# EAGLE design ApoBoard_2017_V0_3 (EAGLE 7.3.0)
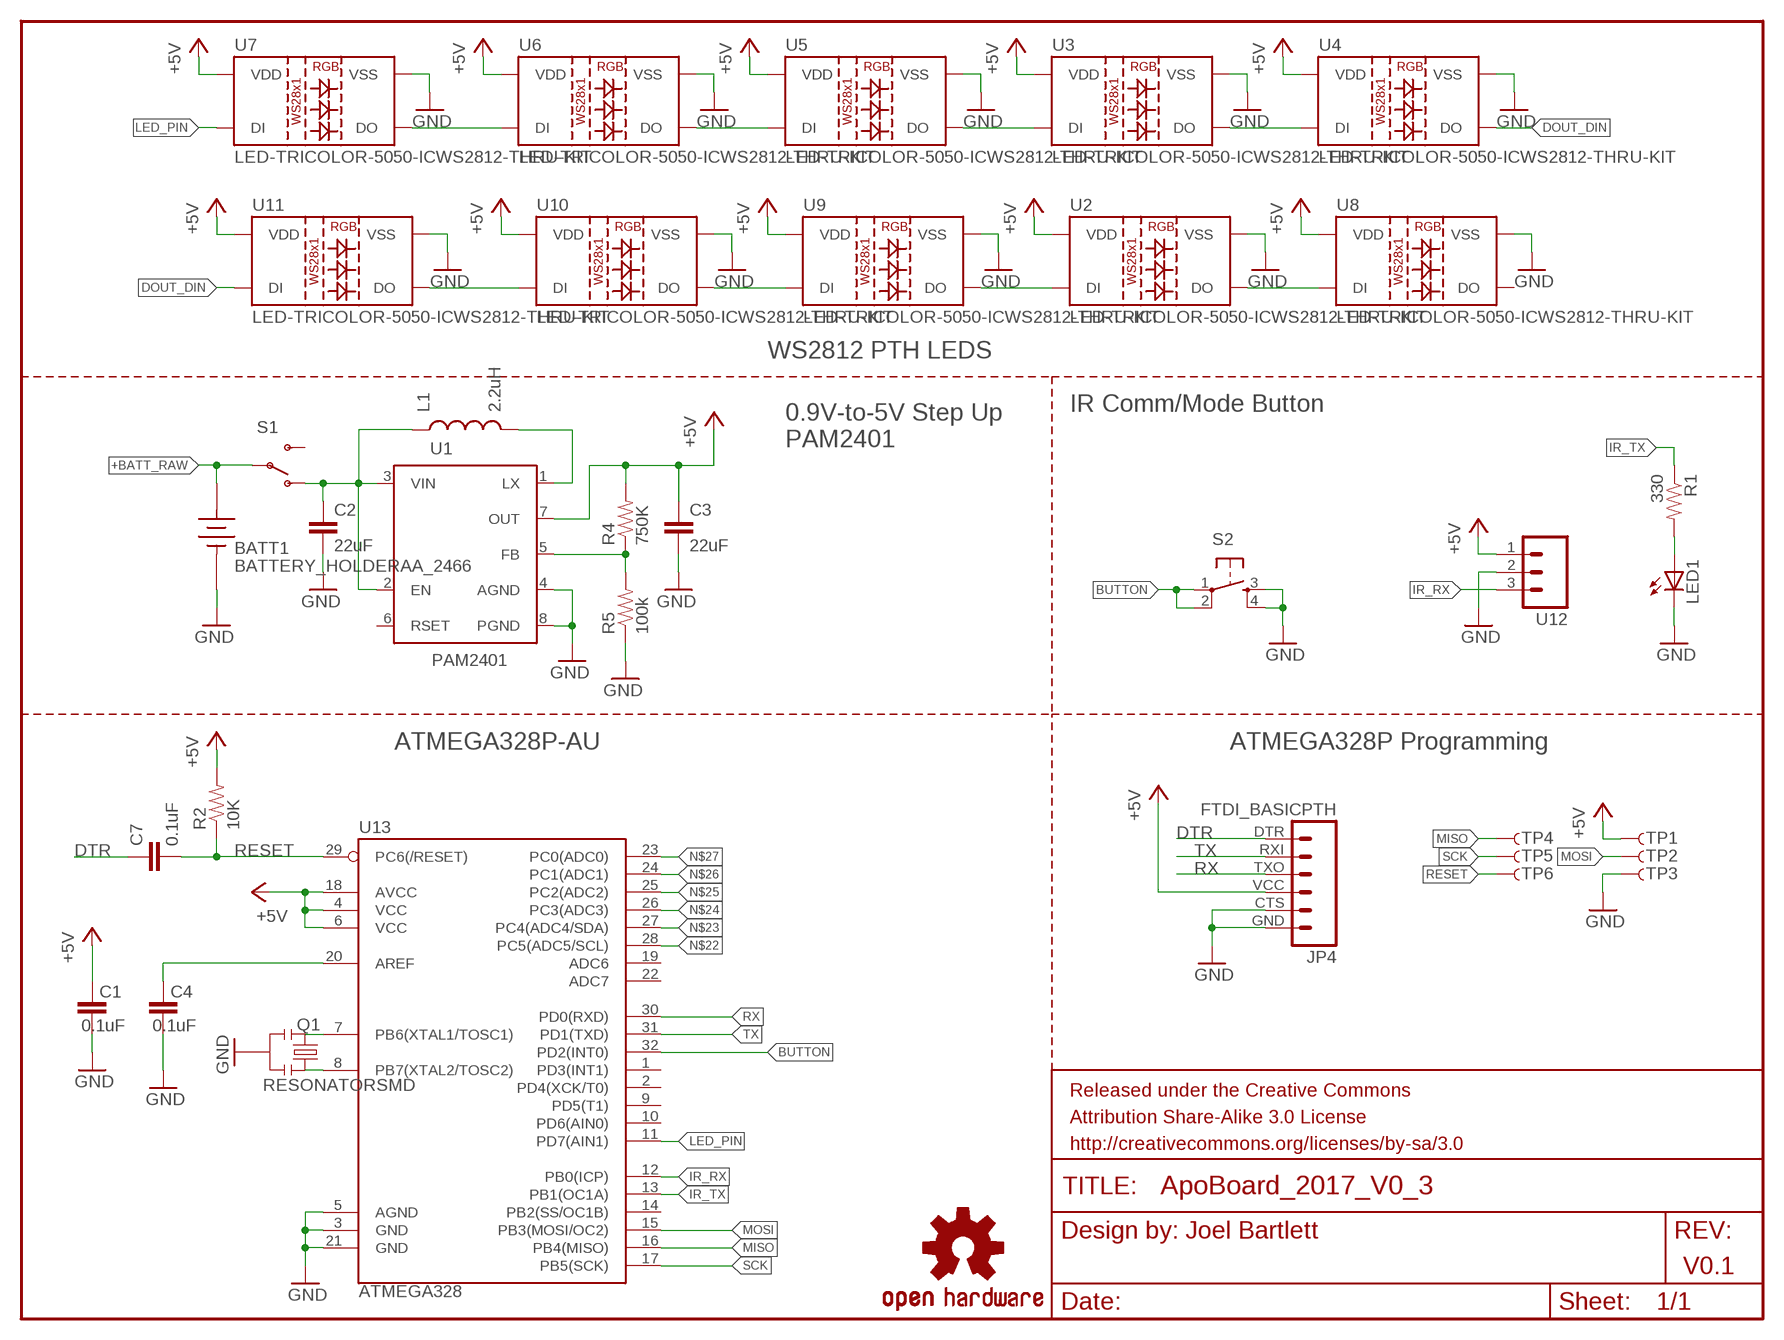
[diagram p0: schematic, sheet 1]

## Parts
BATT1  BATTERY_HOLDERAA_2466  [BATT_HOLDER_AA_2466]
C1  0.1uF  CAP0402-CAP  [0402-CAP]
C2  22uF  22UF-6.3V-20%(0805)  [0805]
C3  22uF  22UF-6.3V-20%(0805)  [0805]
C4  0.1uF  CAP0402-CAP  [0402-CAP]
C7  0.1uF  CAP0402-CAP  [0402-CAP]
FRAME1  FRAME-LETTER  [CREATIVE_COMMONS]
JP4  FTDI_BASICPTH  [FTDI_BASIC]
L1  2.2uH  INDUCTOR.  [CDRH2D09]
LED1  LED5MM-KIT  [LED5MM-KIT]
LOGO1  OSHW-LOGOS  [OSHW-LOGO-S]
Q1  RESONATORSMD  [RESONATOR-SMD]
R1  330  RESISTORKIT  [AXIAL-0.3-KIT]
R2  10K  RESISTOR0402-RES  [0402-RES]
R4  750K  10K-1%RES-00824  [0603-RES]
R5  100k  10K-1%RES-00824  [0603-RES]
S1  SWITCH-SPSTKIT  [SWITCH-SPDT_KIT]
S2  TAC_SWITCHPTH  [TACTILE-PTH]
TP1  TP-3x5  TEST-POINT3X5  [PAD.03X.05]
TP2  TP-3x5  TEST-POINT3X5  [PAD.03X.05]
TP3  TP-3x5  TEST-POINT3X5  [PAD.03X.05]
TP4  TP-3x5  TEST-POINT3X5  [PAD.03X.05]
TP5  TP-3x5  TEST-POINT3X5  [PAD.03X.05]
TP6  TP-3x5  TEST-POINT3X5  [PAD.03X.05]
U1  PAM2401  [MSOP8]
U2  LED-TRICOLOR-5050-ICWS2812-THRU-KIT  [LED-RGB-THRU-KIT]
U3  LED-TRICOLOR-5050-ICWS2812-THRU-KIT  [LED-RGB-THRU-KIT]
U4  LED-TRICOLOR-5050-ICWS2812-THRU-KIT  [LED-RGB-THRU-KIT]
U5  LED-TRICOLOR-5050-ICWS2812-THRU-KIT  [LED-RGB-THRU-KIT]
U6  LED-TRICOLOR-5050-ICWS2812-THRU-KIT  [LED-RGB-THRU-KIT]
U7  LED-TRICOLOR-5050-ICWS2812-THRU-KIT  [LED-RGB-THRU-KIT]
U8  LED-TRICOLOR-5050-ICWS2812-THRU-KIT  [LED-RGB-THRU-KIT]
U9  LED-TRICOLOR-5050-ICWS2812-THRU-KIT  [LED-RGB-THRU-KIT]
U10  LED-TRICOLOR-5050-ICWS2812-THRU-KIT  [LED-RGB-THRU-KIT]
U11  LED-TRICOLOR-5050-ICWS2812-THRU-KIT  [LED-RGB-THRU-KIT]
U12  M03IR_RECEIVER  [1X03_IR_RECEIVER]
U13  ATMEGA328  ATMEGA168  [TQFP32-08]

## Nets
+5V: C1.2 C3.1 JP4.VCC R2.2 R4.2 TP1.P$1 U1.7(OUT) U2.2(VDD) U3.2(VDD) U4.2(VDD) U5.2(VDD) U6.2(VDD) U7.2(VDD) U8.2(VDD) U9.2(VDD) U10.2(VDD) U11.2(VDD) U12.1 U13.4(VCC) U13.6(VCC) U13.18(AVCC)
+BATT_RAW: BATT1.P S1.2(P)
AREF: C4.2 U13.20(AREF)
BUTTON: S2.1 S2.2 U13.32(PD2(INT0))
DOUT_DIN: U4.4(DO) U11.1(DI)
DTR: C7.1 JP4.DTR
GND: BATT1.N C1.1 C2.2 C3.2 C4.1 JP4.CTS JP4.GND LED1.K(C) Q1.2 R5.1 S2.3 S2.4 TP3.P$1 U1.4(AGND) U1.8(PGND) U2.3(VSS) U3.3(VSS) U4.3(VSS) U5.3(VSS) U6.3(VSS) U7.3(VSS) U8.3(VSS) U9.3(VSS) U10.3(VSS) U11.3(VSS) U12.2 U13.3(GND) U13.5(AGND) U13.21(GND)
IR_RX: U12.3 U13.12(PB0(ICP))
IR_TX: R1.P$1 U13.13(PB1(OC1A))
LED_PIN: U7.1(DI) U13.11(PD7(AIN1))
MISO: TP4.P$1 U13.16(PB4(MISO))
MOSI: TP2.P$1 U13.15(PB3(MOSI/OC2))
N$1: U6.1(DI) U7.4(DO)
N$2: U5.1(DI) U6.4(DO)
N$3: LED1.A R1.P$2
N$5: U3.1(DI) U5.4(DO)
N$6: U3.4(DO) U4.1(DI)
N$8: L1.P$2 U1.1(LX)
N$9: U10.1(DI) U11.4(DO)
N$10: C2.1 L1.P$1 S1.1(O) U1.2(EN) U1.3(VIN)
N$11: U9.1(DI) U10.4(DO)
N$12: R4.1 R5.2 U1.5(FB)
N$13: U2.1(DI) U9.4(DO)
N$14: U2.4(DO) U8.1(DI)
N$22: U13.28(PC5(ADC5/SCL))
N$23: U13.27(PC4(ADC4/SDA))
N$24: U13.26(PC3(ADC3))
N$25: U13.25(PC2(ADC2))
N$26: U13.24(PC1(ADC1))
N$27: U13.23(PC0(ADC0))
N$29: Q1.1 U13.8(PB7(XTAL2/TOSC2))
N$30: Q1.3 U13.7(PB6(XTAL1/TOSC1))
RESET: C7.2 R2.1 TP6.P$1 U13.29(PC6(/RESET))
RX: JP4.TXO U13.30(PD0(RXD))
SCK: TP5.P$1 U13.17(PB5(SCK))
TX: JP4.RXI U13.31(PD1(TXD))
Unconnected: S1.3(S) U1.6(RSET) U8.4(DO) U13.1(PD3(INT1)) U13.2(PD4(XCK/T0)) U13.9(PD5(T1)) U13.10(PD6(AIN0)) U13.14(PB2(SS/OC1B)) U13.19(ADC6) U13.22(ADC7)

## Notes on the sheet
- WS2812 PTH LEDS
- IR Comm/Mode Button
- 0.9V-to-5V Step Up
  PAM2401
- ATMEGA328P-AU | ATMEGA328P Programming
- Joel Bartlett
- V0.1

## Library data of the parts
BATT1 = 1_BES_ELECTROMECHANICAL:BATTERY_HOLDER
C1 C4 C7 = SparkFun:CAP: Capacitor Standard 0603 ceramic capacitor, and 0.1" leaded capacitor.
C2 C3 = SparkFun-Capacitors:22UF-6.3V-20%(0805): Ceramic CAP-08402; PROD_ID: CAP-08402
FRAME1 = SparkFun-Aesthetics:FRAME-LETTER: Schematic Frame Standard 8.5x11 US Letter frame
JP4 = SparkFun-Connectors:FTDI_BASIC: FTDI Basic header with labels
L1 = SparkFun-Passives:INDUCTOR: Inductors Basic Inductor/Choke - 0603 and 1206. Footprints are not proven and vary greatly between part numbers.
LED1 = SparkFun-LED:LED: LEDs Standard schematic elements and footprints for 5mm, 3mm, 1206, and 0603 sized LEDs. 5mm - Spark Fun Electronics SKU : COM-00529 (and others)
LOGO1 = SparkFun-Aesthetics:OSHW-LOGO: Open Source Hardware Logo This logo indicates the piece of hardware it is found on incorporates a OSHW license and/or adheres to the definition of open source hardware found here: http://freedomdefined.org/OSHW
Q1 = SparkFun:RESONATOR: Resonator Small SMD resonator. This is the itty bitty 10/20MHz resonators with built in caps. CSTCE10M0G55 and CSTCE20M0V53. Footprint has been reviewed closely but hasn't been tested yet.
R1 = SparkFun-Resistors:RESISTOR: Resistor Basic schematic elements and footprints for 0603, 1206, and PTH resistors.
R2 = SparkFun:RESISTOR: Resistor Basic schematic elements and footprints for 0603, 1206, and PTH resistors.
R4 R5 = SparkFun-Resistors:10K-1%: 10k-ohm SMT 1/10W - 1% (0603) RES-00824; PROD_ID: RES-00824; VALUE: 10k
S1 = SparkFun:SWITCH-SPST: SPST Switch Simple slide switch. Spark Fun Electronics SKU : COM-00102
S2 = SparkFun-Electromechanical:TAC_SWITCH: Momentary Switch Button commonly used for reset or general input. Spark Fun Electronics SKU : COM-00097 SMT- SWCH-08247
TP1-TP6 = SparkFun-Passives:TEST-POINT: Bare copper test points for troubleshooting or ICT
U1 = SparkFun-PowerIC:PAM2401
U2-U11 = SparkFun-LED:LED-TRICOLOR-5050-IC: KIT KIT KITr 5x5mm SMD LED with built-in controller IC. DIO-11598
U12 = SparkFun-Connectors:M03: Header 3 Standard 3-pin 0.1" header. Use with straight break away headers (SKU : PRT-00116), right angle break away headers (PRT-00553), swiss pins (PRT-00743), machine pins (PRT-00117), and female headers (PRT-00115). Molex polarized connector foot print use with SKU : PRT-08232 with associated crimp pins and housings.
U13 = SparkFun:ATMEGA168

## Net classes
0 default: width 0.152 mm, drill 0.305 mm, clearance 0.152 mm
1 vcc: width 0.254 mm
3 ButtonSignal: width 0.254 mm

## Board
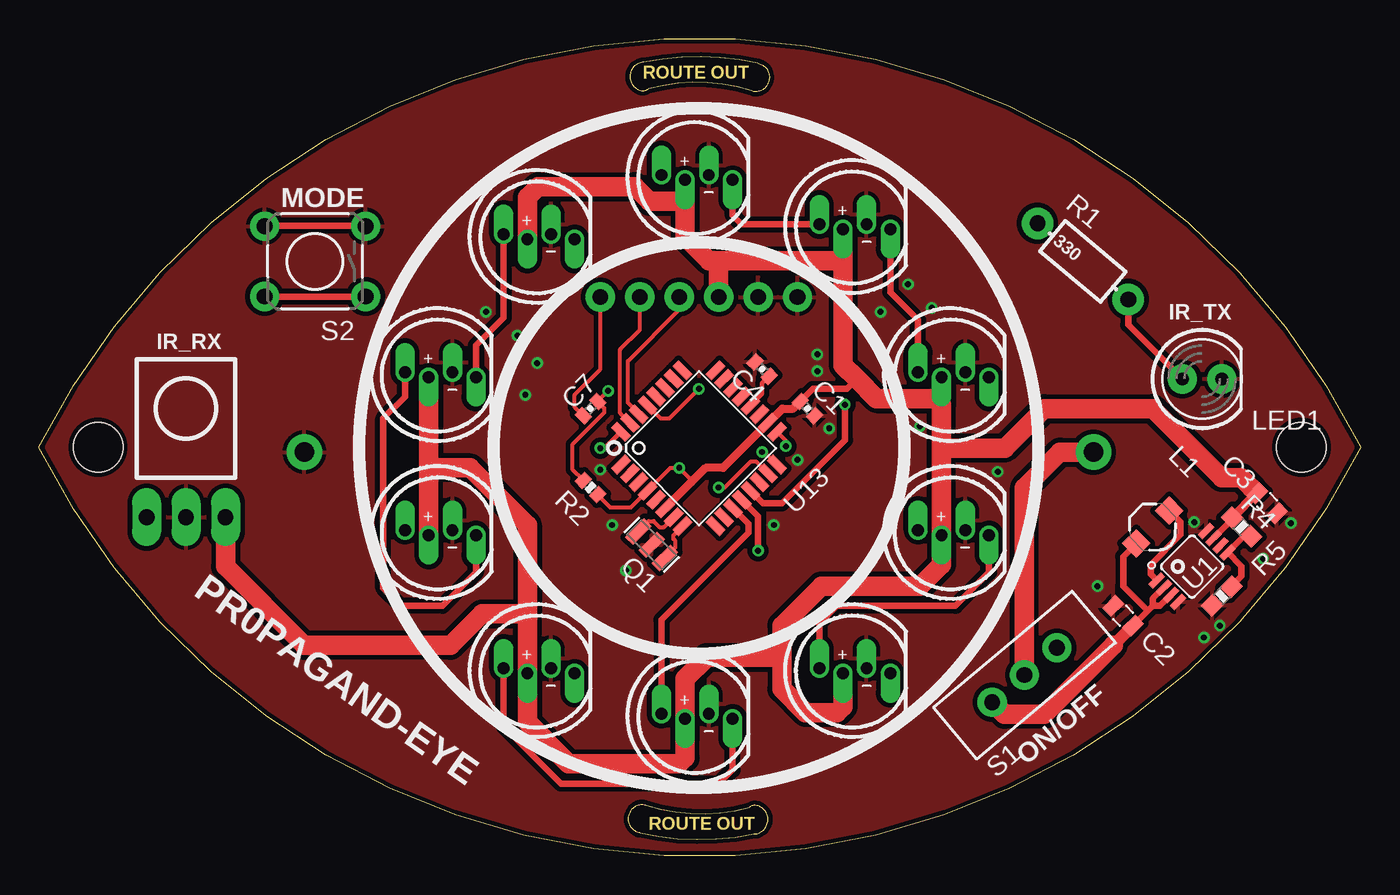
[diagram p1: board, top side]
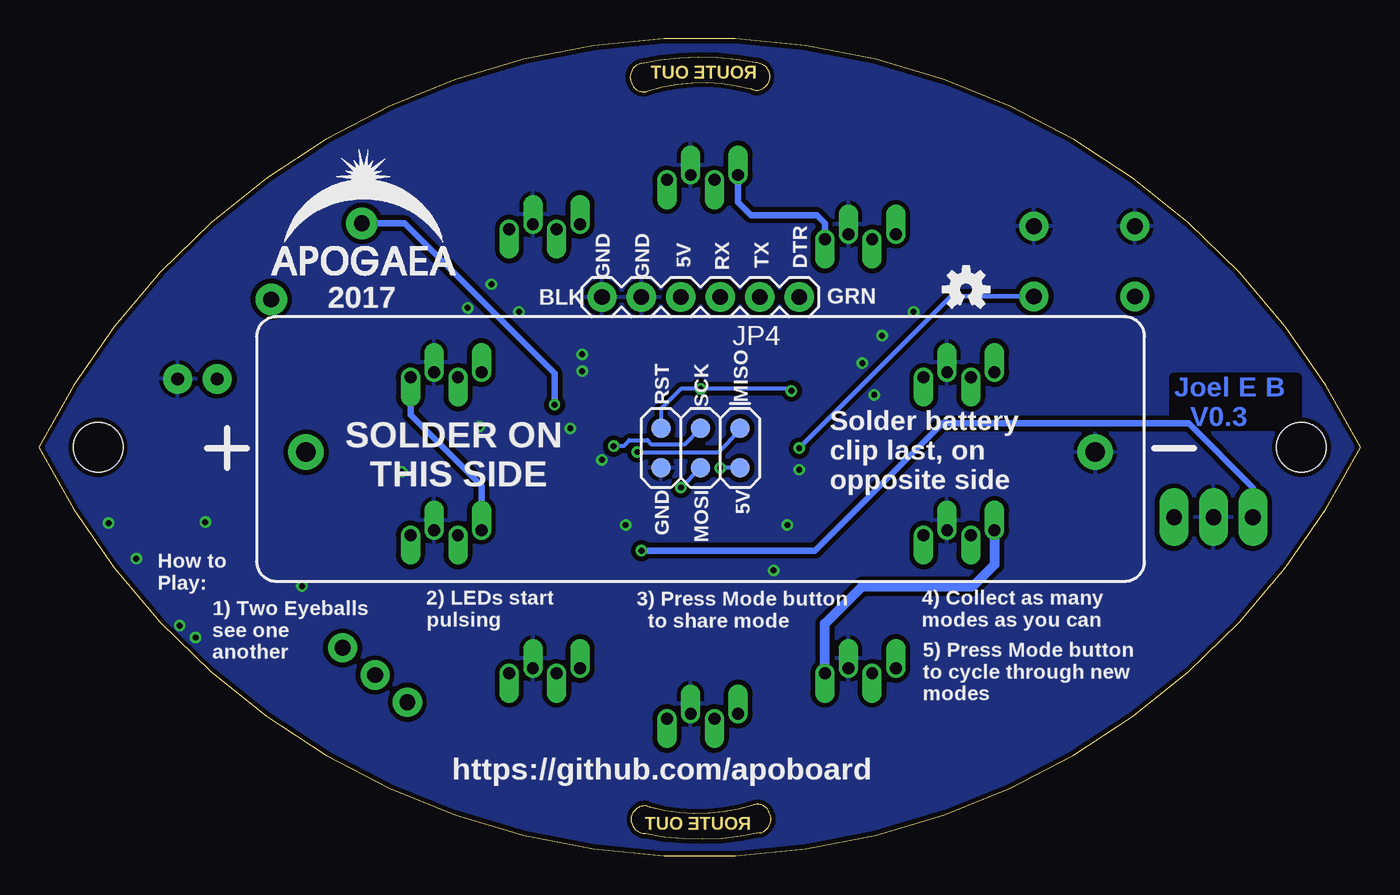
[diagram p2: board, bottom side, seen from below]

Size 85.09 x 52.56 mm. Coordinates in mm from the lower left corner, seen from the top.
Outline: 0,26.28 arc-127 85.09,26.28 arc-127 0,26.28
Outline: 38.68,1.47 arc24 46.05,1.4 arc171 46.11,3.24 arc25 45.73,3.12 arc-33 39.13,3.24 arc93 38.05,2.74 arc103 38.68,1.47
Outline: 46.3,51 arc24 38.94,51.06 arc171 38.88,49.22 arc25 39.26,49.35 arc-33 45.86,49.22 arc93 46.94,49.73 arc103 46.3,51
Copper layers (1*16): Top 0.035mm / dielectric 1.5mm / Bottom 0.035mm
Design rules "SparkFun-2-layer-TIGHT": minimum track width 7mil, minimum drill 15mil, track to track 7mil, track to pad 7mil, pad to pad 7mil, via to via 7mil, smd to smd 7mil, copper to edge 7mil, drill to drill 7mil, minimum pad ring 7mil, minimum via ring 7mil, stop-mask expansion 4mil, vias tented up to drill 25mil, thermal gap 10mil
Holes 3.17 mm at 3.81,26.28 81.28,26.28

### Footprints (pad centres in the part's own frame; a part is rotated, then mirrored left to right if it is on the bottom)
BATT_HOLDER_AA_2466 = drill 1.27 pad 2.286: N -25.4,0.254; P 25.4,0.254
0402-CAP = smd 0.7 x 0.9: 1 -0.65,0; 2 0.65,0
0805 = smd 0.8 x 1.2: 1 -0.9,0; 2 0.9,0
FTDI_BASIC = drill 1.016 pad 1.88: CTS 10.16,0; DTR 0,0; GND 12.7,0; RXI 2.54,0; TXO 5.08,0; VCC 7.62,0
CDRH2D09 = smd 1.3 x 1.3: P$1 -1.5,0; P$2 1.5,0
LED5MM-KIT = drill 0.813 pad 1.88: A -1.27,0; K 1.27,0
RESONATOR-SMD = smd 0.7 x 1.7: 1 -1.2,0; 2 0,0; 3 1.2,0
AXIAL-0.3-KIT = drill 1.016 pad 2.032: P$1 -3.81,0; P$2 3.81,0
0402-RES = smd 0.7 x 0.9: 1 -0.65,0; 2 0.65,0
0603-RES = smd 1.1 x 1: 1 -0.85,0; 2 0.85,0
SWITCH-SPDT_KIT = drill 1.016 pad 1.88: 1 0,2.718; 2 0,0; 3 0,-2.718
TACTILE-PTH = drill 1.016 pad 1.88: 1 -3.251,2.261; 2 3.251,2.261; 3 -3.251,-2.261; 4 3.251,-2.261
PAD.03X.05 = smd 1.27 x 1.27: P$1 0,0
MSOP8 = smd 0.4 x 1.1: 1 -0.975,-2.25; 2 -0.325,-2.25; 3 0.325,-2.25; 4 0.975,-2.25; 5 0.975,2.25; 6 0.325,2.25; 7 -0.325,2.25; 8 -0.975,2.25
LED-RGB-THRU-KIT = drill 0.762 pad 1.27 offset: 1 2.413,0.206; 2 0.889,0.524; 3 -0.635,0.206; 4 -2.159,0.524
1X03_IR_RECEIVER = drill 1.016 pad 1.88 long: 1 2.54,0; 2 0,0; 3 -2.54,0
TQFP32-08 = smd 1.27 x 0.559: 1 -4.293,2.8; 2 -4.293,2; 3 -4.293,1.2; 4 -4.293,0.4; 5 -4.293,-0.4; 6 -4.293,-1.2; 7 -4.293,-2; 8 -4.293,-2.8; 17 4.293,-2.8; 18 4.293,-2; 19 4.293,-1.2; 20 4.293,-0.4; 21 4.293,0.4; 22 4.293,1.2; 23 4.293,2; 24 4.293,2.8 | smd 0.559 x 1.27: 9 -2.8,-4.293; 10 -2,-4.293; 11 -1.2,-4.293; 12 -0.4,-4.293; 13 0.4,-4.293; 14 1.2,-4.293; 15 2,-4.293; 16 2.8,-4.293; 25 2.8,4.293; 26 2,4.293; 27 1.2,4.293; 28 0.4,4.293; 29 -0.4,4.293; 30 -1.2,4.293; 31 -2,4.293; 32 -2.8,4.293

### Placement (x,y rotation side)
BATT1  42.49,26.23 180 bottom
C1  49.48,28.77 135 top
C2  69.8,15.44 135 top
C3  79.07,22.68 315 top
C4  46.56,31.31 315 top
C7  35.51,28.77 45 top
FRAME1  20.68,-13.47 0 top  (outside the outline)
JP4  36.14,35.95 180 bottom
L1  71.7,21.15 45 top
LED1  74.88,30.68 0 top
LOGO1  25.4,36.44 0 bottom
Q1  39.45,20.01 135 top
R1  67.21,38.25 320 top
R2  35.51,23.69 315 top
R4  77.42,21.15 135 top
R5  76.15,16.71 45 top
S1  63.45,11.63 130 top
S2  17.78,38.25 180 top
TP1  39.95,24.96 270 bottom
TP2  42.49,24.96 270 bottom
TP3  45.03,24.96 270 bottom
TP4  39.95,27.5 270 bottom
TP5  42.49,27.5 270 bottom
TP6  45.03,27.5 270 bottom
U1  74.24,18.61 315 top
U2  59,21.15 180 top
U3  25.98,31.31 180 top
U4  32.33,40.2 180 top
U5  25.98,21.15 180 top
U6  32.33,12.26 180 top
U7  42.49,9.34 180 top
U8  52.65,12.26 180 top
U9  59,31.31 180 top
U10  52.65,40.84 180 top
U11  42.49,44.01 180 top
U12  9.47,21.79 0 top
U13  42.49,26.23 45 top
U$2  [APOLOGO]  70.12,37.34 0 bottom

### Tracks (layer width: path | path; a pad name or v marks a point on that pad's centre or on a via)
+5V  (via drill 0.38)
  Top 0.254: R2.2 36.78,22.42 38.12,22.42 U13.4 40.66,24.96 v41.22,24.96 41.99,24.2 arc-90 41.99,24.03
  Top 0.381: U1.7 76.82,21.65
  Top 0.406: C1.2 49.83,30.04 52.02,30.04 52.65,30.68
  Top 0.508: C1.2 48.56,28.77 47.86,28.77 U13.18 44.05,24.96 42.92,24.96 41.99,24.03 U13.6
  Top 0.61: C3.1 78.38,23.31 R4.2 76.82,21.65
  Top 0.813: 78.31,23.44 C3.1 78.05,23.69
  Top 1.27: 41.61,42.11 U11.2 | U10.2 51.77,38.3 | 51.77,38.3 51.77,31.57 52.65,30.68 53.92,29.41 57.73,29.41 | 58.12,26.23 U2.2 58.12,18.74 56.72,17.34 50.37,17.34 47.83,14.8 47.83,12.26 | 58.12,26.23 58.12,29.03 57.73,29.41 | 47.83,12.26 47.83,10.74 49.35,9.21 51.38,9.21 51.77,9.59 U8.2 | 31.45,15.56 U6.2 31.45,8.58 34.11,5.91 41.22,5.91 41.61,6.29 U7.2 41.61,11.37 43,12.77 47.32,12.77 arc-90 47.83,12.26 | 25.22,24.96 27.76,24.96 31.45,21.28 31.45,15.56 | U5.2 25.1,24.83 25.22,24.96 | U3.2 25.1,25.09 25.22,24.96 | 31.45,15.56 28.52,15.56 26.49,13.53 17.09,13.53 12.01,18.61 U12.1 | 57.73,29.41 58.12,29.79 U9.2 | JP4.VCC 43.76,38.3 | U4.2 31.45,42.36 32.14,43.06 38.37,43.06 39.32,42.11 41.61,42.11 | 41.61,42.11 41.61,39.82 43.13,38.3 43.76,38.3 | 43.76,38.3 51.77,38.3 | 58.12,26.23 62.18,26.23 64.72,28.77 71.7,28.77 76.15,24.33 77.42,24.33 78.05,23.69
  Bottom 0.254: TP1.P$1 v41.22,24.96
+BATT_RAW
  Top 1.27: S1.2 63.45,23.69 65.74,25.98 BATT1.P
AREF
  Top 0.305: C4.2 46.56,30.39 46.56,29.72 U13.20
BUTTON  (via drill 0.38)
  Top 0.254: S2.1 S2.2
  Top 0.305: U13.32 36.42,26.23 v36.14,26.23
  Bottom 0.305: v36.14,26.23 26.39,35.99 S2.1
DOUT_DIN
  Bottom 0.406: U4.4 34.49,40.71 35,41.22 39.26,41.22 40.08,42.04 U11.1
DTR
  Top 0.254: C7.1 34.49,28.87 34.49,29.66 36.14,31.31 JP4.DTR
GND  (via drill 0.38)
  other vias: 36.14,24.83 36.91,21.28 50.88,27.5 37.8,18.36 74.37,21.47 75.01,14.04 68.15,17.34 61.73,24.71 78.82,19.12 80.59,21.41 47.32,21.28 50.11,31.18 54.18,34.99 55.96,36.77 57.48,35.25 50.11,32.26 28.78,34.99 32.08,31.69 31.32,29.66 30.81,33.47 56.72,27.63 48.84,25.47 76.02,14.8
  pour Top (isolate 0.305): 85.67,54.17 85.67,-1.71 -0.69,-1.71 -0.69,54.17
  pour Bottom (isolate 0.305): 85.67,54.17 -0.69,54.17 -0.69,-1.71 85.67,-1.71
IR_RX  (via drill 0.38)
  Top 0.406: U13.12 46.3,21.86 v46.3,19.63
  Bottom 0.406: v46.3,19.63 35.13,19.63 26.94,27.82 11.06,27.82 6.93,23.69 U12.3
IR_TX  (via drill 0.38)
  Top 0.406: U13.13 46.62,22.68 47.83,22.68 51.89,26.74 v51.89,29.03
  Bottom 0.406: v51.89,29.03 51.89,31.06 61.53,40.69 R1.P$1
LED_PIN
  Top 0.406: U13.11 45.67,21.36 45.67,20.77 40.08,15.18 U7.1
MISO  (via drill 0.38)
  Top 0.254: 47.49,25.18 U13.16 46.71,25.98 v46.56,25.98
  Bottom 0.254: v46.56,25.98 41.35,25.98 39.95,27.37 TP4.P$1
MOSI  (via drill 0.38)
  Top 0.254: U13.15 46.21,25.34 45.8,25.34 44.15,23.69 v43.76,23.69
  Bottom 0.254: v43.76,23.69 TP2.P$1
N$1
  Top 0.406: U6.1 29.92,8.32 33.6,4.64 43.76,4.64 44.65,5.53 U7.4
N$2
  Bottom 0.635: U6.4 34.49,14.93 32.08,17.34 24.97,17.34 23.57,18.74 U5.1
N$3
  Top 0.406: R1.P$2 70.13,34.16 LED1.A
N$5
  Top 0.406: U5.4 28.14,18.23 25.98,16.07 23.32,16.07 22.17,17.21 22.17,28.14 23.57,29.53 U3.1
N$6
  Top 0.406: U4.1 29.92,34.61 28.14,32.84 U3.4
N$8
  Top 0.406: U1.1 71.58,18.1 71.58,18.74 73.48,20.64 73.48,21.49 L1.P$2
N$9
  Top 0.406: U11.4 44.65,41.22 45.24,40.63 U10.1
N$10
  Top 0.406: 71.7,16.07 72.16,16.07 U1.3 | U1.2 71.79,16.62 | 71.79,16.62 71.7,16.53 71.7,16.07 | 71.7,16.07 71.39,15.75 | 71.39,15.75 C2.1 | L1.P$1 69.8,19.25 69.8,17.34 71.39,15.75 | 71.79,16.62
  Top 0.813: C2.1 69.17,13.53
  Top 1.27: 69.17,13.53 64.72,9.09 62.16,9.09 S1.1
N$11
  Top 0.406: U9.1 56.59,34.49 54.81,36.26 U10.4
N$12
  Top 0.406: R5.2 77.42,17.98 77.42,18.62 U1.5 77.56,20.55 R4.1
N$13
  Bottom 0.406: U9.4 61.16,28.39 56.59,23.82 U2.1
N$14
  Top 0.406: U8.1 50.24,14.93 51.38,16.07 59,16.07 61.16,18.23 U2.4
N$29
  Top 0.254: U13.8 40.84,20.62 40.84,20.39 40.97,20.26 40.97,19.84 Q1.1
N$30
  Top 0.254: Q1.3 39.27,21.53 39.57,21.53 39.95,21.15 40.24,21.15 U13.7
RESET  (via drill 0.38)
  Top 0.254: U13.29 40.02,28.14 40.59,28.14 v42.49,30.04 | R2.1 34.37,24.83 34.37,26.49 36.4,28.52 36.4,28.8 C7.2 v36.65,29.91
  Bottom 0.254: v36.65,29.91 36.78,30.04 v42.49,30.04 43.76,30.04 45.03,28.77 TP6.P$1
RX
  Top 0.254: U13.30 38.61,28.46 37.92,29.15 37.92,31.82 41.22,35.12 JP4.TXO
SCK  (via drill 0.38)
  Top 0.254: v48.08,26.36 48.08,26.71 U13.17
  Bottom 0.254: v48.08,26.36 47.45,26.36 47.07,26.74 45.92,26.74 45.67,26.49 43.51,26.49 TP5.P$1 42.62,27.5
TX
  Top 0.254: 38.04,27.89 U13.31 37.41,28.48 37.41,32.58 38.68,33.85 JP4.RXI

### Text on the board
Bottom: Joel E B / V0.3
Dimension: ROUTE OUT | ROUTE OUT
tPlace: MODE | IR_TX | IR_RX | PR0PAGAND-EYE | ON/OFF
bPlace: GND | GND | TX | RX | 5V | DTR | GRN | BLK | 2017 | MISO | SCK | RST | SOLDER ON / THIS SIDE | Solder battery / clip last, on / opposite side | 5V | MOSI | GND | How to / Play: | 4) Collect as many / modes as you can | 2) LEDs start / pulsing | 3) Press Mode button / to share mode | 1) Two Eyeballs / see one / another | 5) Press Mode button / to cycle through new / modes | https://github.com/apoboard
tValues: Joel Bartlett